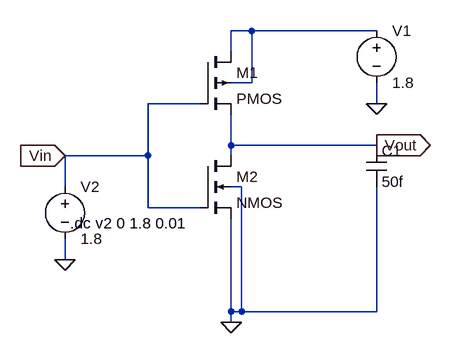
[diagram p0: schematic coms_vtc.asc]
coms_vtc.asc, the LTspice schematic file:
Version 4
SHEET 1 880 680
WIRE 240 32 208 32
WIRE 432 32 240 32
WIRE 208 64 208 32
WIRE 240 112 240 32
WIRE 240 112 208 112
WIRE 160 144 80 144
WIRE 432 144 432 112
WIRE 208 208 208 160
WIRE 432 208 208 208
WIRE 80 224 80 144
WIRE 80 224 -48 224
WIRE 208 224 208 208
WIRE -48 272 -48 224
WIRE 224 272 208 272
WIRE 80 304 80 224
WIRE 160 304 80 304
WIRE -48 384 -48 352
WIRE 208 464 208 320
WIRE 224 464 224 272
WIRE 224 464 208 464
WIRE 432 464 432 272
WIRE 432 464 224 464
WIRE 208 480 208 464
FLAG 208 480 0
FLAG 432 144 0
FLAG -48 384 0
FLAG -48 224 Vin
IOPIN -48 224 In
FLAG 432 208 Vout
IOPIN 432 208 Out
SYMBOL pmos4 160 64 R0
SYMATTR InstName M1
SYMATTR Value2 l=180nm w=270nm
SYMBOL nmos4 160 224 R0
SYMATTR InstName M2
SYMATTR Value2 l=180nm w=270nm
SYMBOL voltage 432 16 R0
WINDOW 123 0 0 Left 0
WINDOW 39 0 0 Left 0
SYMATTR InstName V1
SYMATTR Value 1.8
SYMBOL voltage -48 256 R0
WINDOW 123 0 0 Left 0
WINDOW 39 0 0 Left 0
SYMATTR InstName V2
SYMATTR Value 1.8
SYMBOL cap 416 208 R0
SYMATTR InstName C1
SYMATTR Value 50f
TEXT -40 328 Left 2 !.dc v2 0 1.8 0.01

The netlist it stands for:
* coms_vtc.asc
M1 N001 Vin Vout N001 PMOS l=180nm w=270nm
M2 Vout Vin 0 0 NMOS l=180nm w=270nm
V1 N001 0 1.8
V2 Vin 0 1.8
C1 Vout 0 50f
.model NMOS NMOS
.model PMOS PMOS
.lib standard.mos
.dc v2 0 1.8 0.01
.backanno
.end

* Results of the author's LTspice run, read from the files saved beside the schematic
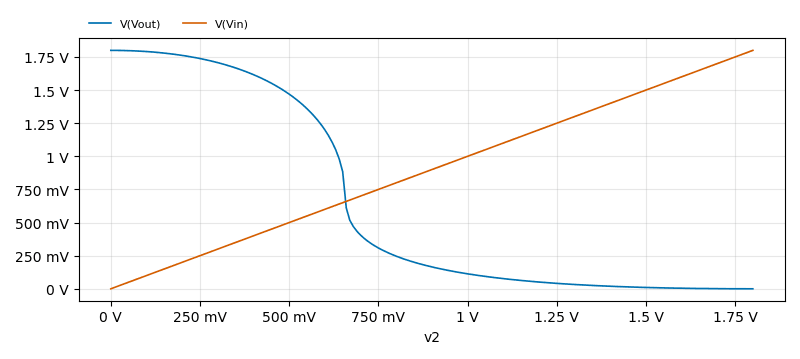
[diagram p1: DC transfer characteristic of coms_vtc.asc, plotted from the saved traces]
* DC transfer characteristic, 1 run:
*   V(Vout): 1.8 V at v2=0 V, 22.19 nV at v2=1.8 V, min 22.19 nV, max 1.8 V
*   V(Vin): 0 V at v2=0 V, 1.8 V at v2=1.8 V, min 0 V, max 1.8 V